# EAGLE design 6502_cable_ada (EAGLE 9.6.2)
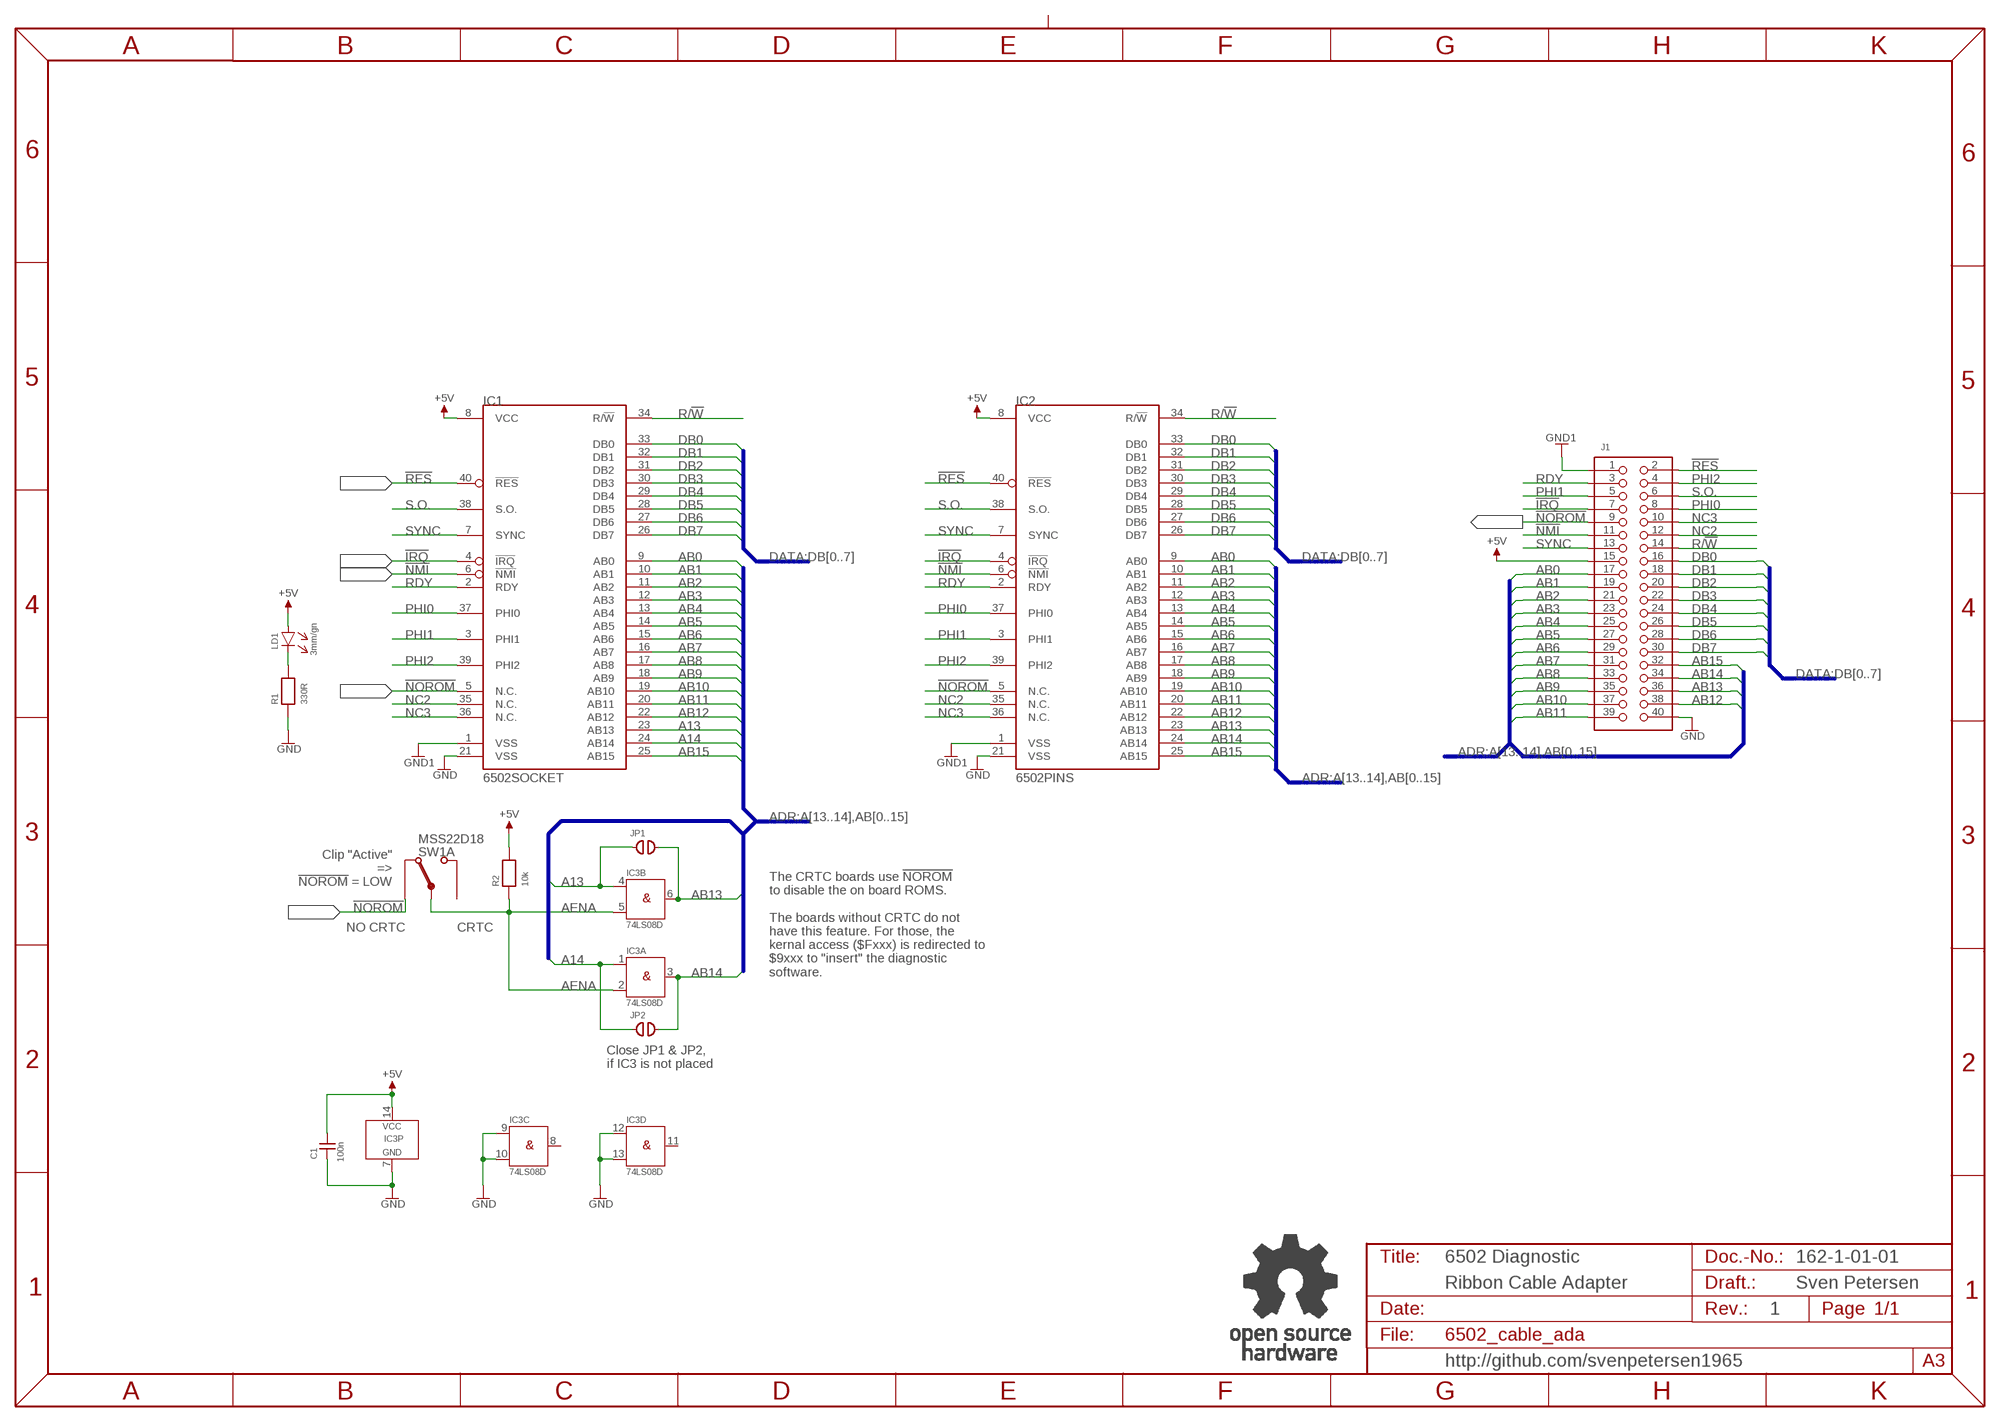
[diagram p0: schematic, sheet 1]

## Parts
C1  100n  C-0805  [0805]
IC1  6502SOCKET  [GS40P]
IC2  6502PINS  [DIL40_PINS_SS]
IC3  74LS08D  74HC08  [SO-14]
J1  PINHD-2X20WV  [2X20WV]
JP1  OPEN  [CP_OP]
JP2  OPEN  [CP_OP]
LD1  3mm/gn  3MM  [3MM]
R1  330R  RES040805  [0805]
R2  10k  RES040805  [0805]
SW1  MSS22D18  DPDT_9MM  [DPDT_9MM]
U$11  OPEN_SOURCE_HW  [OPENHW]

## Nets
!IRQ: IC1.4(!IRQ) IC2.4(!IRQ) J1.7
!NMI: IC1.6(!NMI) IC2.6(!NMI) J1.11
!NOROM: IC1.5(N.C.) IC2.5(N.C.) J1.9 SW1.3(A:DWN)
!RES: IC1.40(!RES) IC2.40(!RES) J1.2
+5V: C1.2 IC1.8(VCC) IC2.8(VCC) IC3.14(P:VCC) J1.15 LD1.A R2.2
A13: IC1.23(AB13) IC3.4(B:I0) JP1.1
A14: IC1.24(AB14) IC3.1(A:I0) JP2.1
AB0: IC1.9(AB0) IC2.9(AB0) J1.17
AB1: IC1.10(AB1) IC2.10(AB1) J1.19
AB2: IC1.11(AB2) IC2.11(AB2) J1.21
AB3: IC1.12(AB3) IC2.12(AB3) J1.23
AB4: IC1.13(AB4) IC2.13(AB4) J1.25
AB5: IC1.14(AB5) IC2.14(AB5) J1.27
AB6: IC1.15(AB6) IC2.15(AB6) J1.29
AB7: IC1.16(AB7) IC2.16(AB7) J1.31
AB8: IC1.17(AB8) IC2.17(AB8) J1.33
AB9: IC1.18(AB9) IC2.18(AB9) J1.35
AB10: IC1.19(AB10) IC2.19(AB10) J1.37
AB11: IC1.20(AB11) IC2.20(AB11) J1.39
AB12: IC1.22(AB12) IC2.22(AB12) J1.38
AB13: IC2.23(AB13) IC3.6(B:O) J1.36 JP1.2
AB14: IC2.24(AB14) IC3.3(A:O) J1.34 JP2.2
AB15: IC1.25(AB15) IC2.25(AB15) J1.32
AENA: IC3.2(A:I1) IC3.5(B:I1) R2.1 SW1.2(A:COM)
DB0: IC1.33(DB0) IC2.33(DB0) J1.16
DB1: IC1.32(DB1) IC2.32(DB1) J1.18
DB2: IC1.31(DB2) IC2.31(DB2) J1.20
DB3: IC1.30(DB3) IC2.30(DB3) J1.22
DB4: IC1.29(DB4) IC2.29(DB4) J1.24
DB5: IC1.28(DB5) IC2.28(DB5) J1.26
DB6: IC1.27(DB6) IC2.27(DB6) J1.28
DB7: IC1.26(DB7) IC2.26(DB7) J1.30
GND: C1.1 IC1.21(VSS) IC2.21(VSS) IC3.7(P:GND) IC3.9(C:I0) IC3.10(C:I1) IC3.12(D:I0) IC3.13(D:I1) J1.40 R1.1
GND1: IC1.1(VSS) IC2.1(VSS) J1.1
N$1: LD1.C(K) R1.2
NC2: IC1.35(N.C.) IC2.35(N.C.) J1.12
NC3: IC1.36(N.C.) IC2.36(N.C.) J1.10
PHI0: IC1.37(PHI0) IC2.37(PHI0) J1.8
PHI1: IC1.3(PHI1) IC2.3(PHI1) J1.5
PHI2: IC1.39(PHI2) IC2.39(PHI2) J1.4
R/!W: IC1.34(R/!W) IC2.34(R/!W) J1.14
RDY: IC1.2(RDY) IC2.2(RDY) J1.3
S.O.: IC1.38(S.O.) IC2.38(S.O.) J1.6
SYNC: IC1.7(SYNC) IC2.7(SYNC) J1.13
Unconnected: IC3.8(C:O) IC3.11(D:O) SW1.1(A:UP) SW1.4(B:DWN) SW1.5(B:COM) SW1.6(B:UP)

## Buses
DATA:DB[0..7]
ADR:A[13..14],AB[0..15]

## Notes on the sheet
- Clip "Active"
  =>
  !NOROM! = LOW
- NO CRTC | CRTC
- The CRTC boards use !NOROM!
  to disable the on board ROMS.
  
  The boards without CRTC do not
  have this feature. For those, the 
  kernal access ($Fxxx) is redirected to
  $9xxx to "insert" the diagnostic
  software.
- Close JP1 & JP2, 
  if IC3 is not placed
- 6502 Diagnostic | 162-1-01-01
- Ribbon Cable Adapter | Sven Petersen
- 1
- http://github.com/svenpetersen1965

## Library data of the parts
C1 = SMD:C-0805
IC1 IC2 = MOS:6502
IC3 = 74XX:74*08: Quad 2-input AND gate SO14
J1 = PINHEAD:PINHD-2X20
JP1 JP2 = Cutpad:OPEN: open Cutpad
LD1 = LED:3MM
R1 R2 = DISCRETE:RES04
SW1 = switches:DPDT_9MM
U$11 = Logo:OPEN_SOURCE_HW

## Board
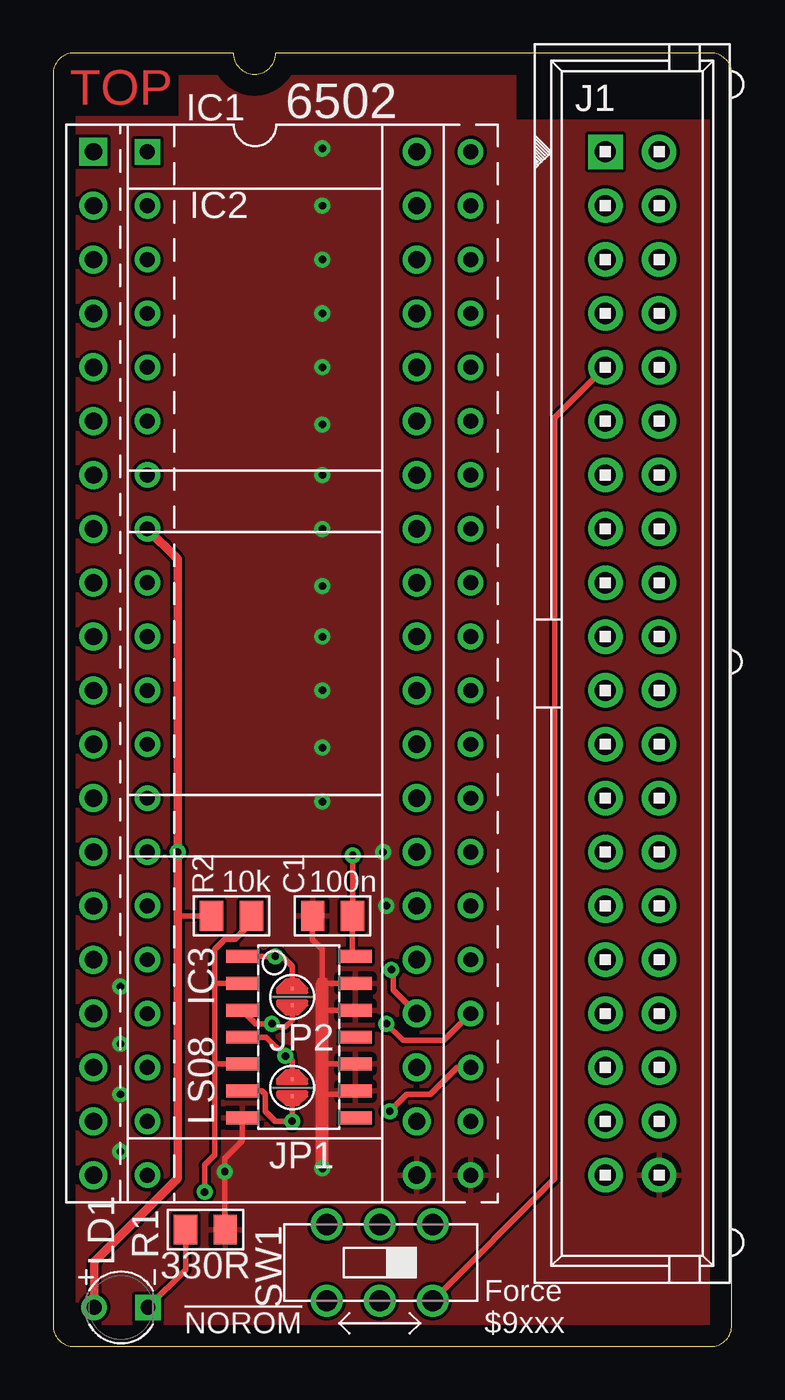
[diagram p1: board, top side]
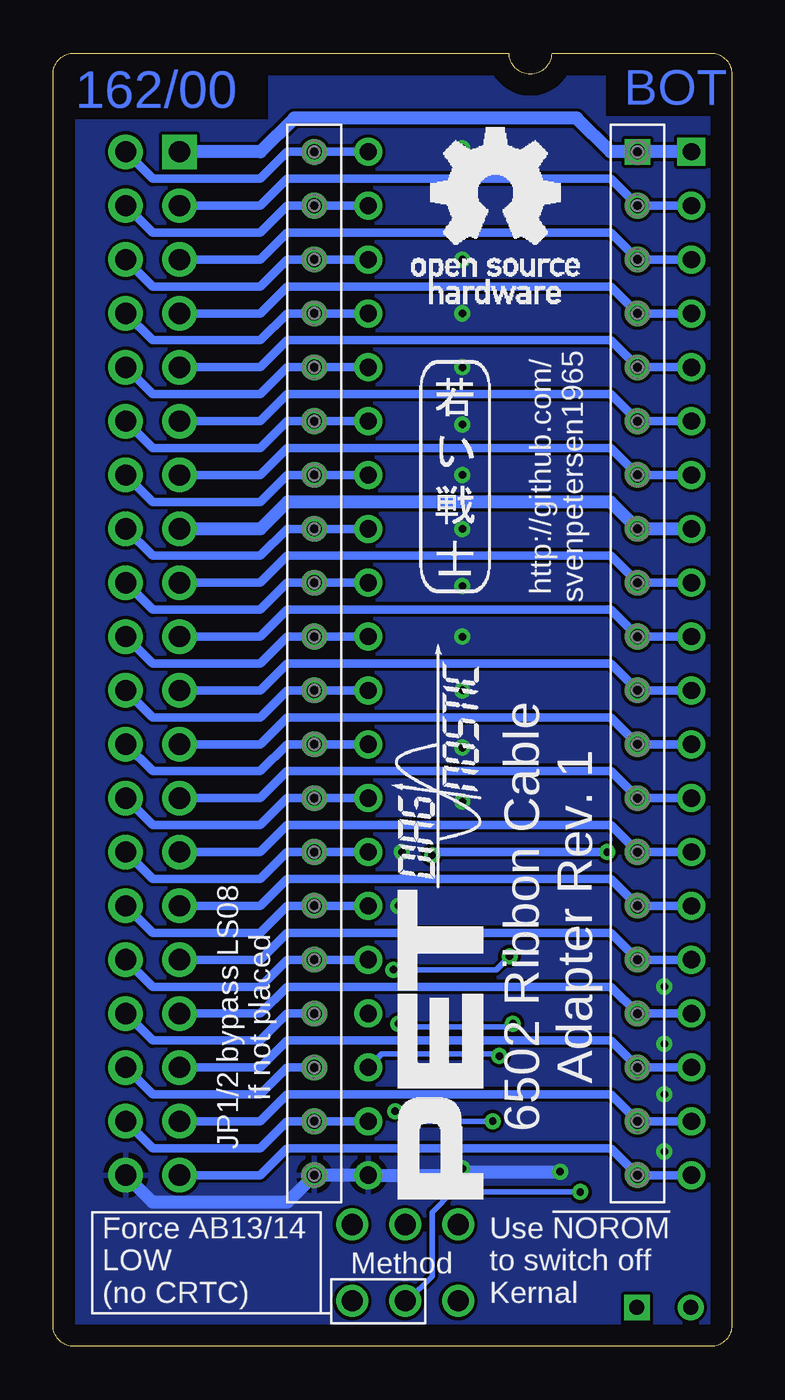
[diagram p2: board, bottom side, seen from below]

Size 32 x 61 mm. Coordinates in mm from the lower left corner, seen from the top.
Outline: 0,60 0,1 arc90 1,0 31,0 arc90 32,1 32,60 arc90 31,61 10.5,61 arc-180 8.5,61 1,61 arc90 0,60
Copper layers (1*16): Top 0.035mm / dielectric 1.5mm / Bottom 0.035mm
Design rules "default *": minimum track width 6mil, minimum drill 0.35mm, track to track 6mil, track to pad 6mil, pad to pad 6mil, via to via 6mil, smd to smd 6mil, copper to edge 40mil, drill to drill 6mil, minimum pad ring 10mil, minimum via ring 8mil, stop-mask expansion 4mil, vias tented up to drill 25mil, thermal gap 10mil
bRestrict: 3 lines

### Footprints (pad centres in the part's own frame; a part is rotated, then mirrored left to right if it is on the bottom)
0805 = smd 1.092 x 1.397: 1 -0.94,0; 2 0.94,0
GS40P = drill 0.813 square: 1 -24.13,-7.62 | drill 0.813: 2 -21.59,-7.62; 3 -19.05,-7.62; 4 -16.51,-7.62; 5 -13.97,-7.62; 6 -11.43,-7.62; 7 -8.89,-7.62; 8 -6.35,-7.62; 9 -3.81,-7.62; 10 -1.27,-7.62; 11 1.27,-7.62; 12 3.81,-7.62; 13 6.35,-7.62; 14 8.89,-7.62; 15 11.43,-7.62; 16 13.97,-7.62; 17 16.51,-7.62; 18 19.05,-7.62; 19 21.59,-7.62; 20 24.13,-7.62; 21 24.13,7.62; 22 21.59,7.62; 23 19.05,7.62; 24 16.51,7.62; 25 13.97,7.62; 26 11.43,7.62; 27 8.89,7.62; 28 6.35,7.62; 29 3.81,7.62; 30 1.27,7.62; 31 -1.27,7.62; 32 -3.81,7.62; 33 -6.35,7.62; 34 -8.89,7.62; 35 -11.43,7.62; 36 -13.97,7.62; 37 -16.51,7.62; 38 -19.05,7.62; 39 -21.59,7.62; 40 -24.13,7.62
DIL40_PINS_SS = drill 0.7 square: 1 -24.13,-7.62 | drill 0.7: 2 -21.59,-7.62; 3 -19.05,-7.62; 4 -16.51,-7.62; 5 -13.97,-7.62; 6 -11.43,-7.62; 7 -8.89,-7.62; 8 -6.35,-7.62; 9 -3.81,-7.62; 10 -1.27,-7.62; 11 1.27,-7.62; 12 3.81,-7.62; 13 6.35,-7.62; 14 8.89,-7.62; 15 11.43,-7.62; 16 13.97,-7.62; 17 16.51,-7.62; 18 19.05,-7.62; 19 21.59,-7.62; 20 24.13,-7.62; 21 24.13,7.62; 22 21.59,7.62; 23 19.05,7.62; 24 16.51,7.62; 25 13.97,7.62; 26 11.43,7.62; 27 8.89,7.62; 28 6.35,7.62; 29 3.81,7.62; 30 1.27,7.62; 31 -1.27,7.62; 32 -3.81,7.62; 33 -6.35,7.62; 34 -8.89,7.62; 35 -11.43,7.62; 36 -13.97,7.62; 37 -16.51,7.62; 38 -19.05,7.62; 39 -21.59,7.62; 40 -24.13,7.62
SO-14 = smd 0.61 x 1.524: 1 -3.81,-2.667; 2 -2.54,-2.667; 3 -1.27,-2.667; 4 0,-2.667; 5 1.27,-2.667; 6 2.54,-2.667; 7 3.81,-2.667; 8 3.81,2.667; 9 2.54,2.667; 10 1.27,2.667; 11 0,2.667; 12 -1.27,2.667; 13 -2.54,2.667; 14 -3.81,2.667
2X20WV = drill 1 pad 1.626 square: 1 -24.13,-1.27 | drill 1 pad 1.626: 2 -24.13,1.27; 3 -21.59,-1.27; 4 -21.59,1.27; 5 -19.05,-1.27; 6 -19.05,1.27; 7 -16.51,-1.27; 8 -16.51,1.27; 9 -13.97,-1.27; 10 -13.97,1.27; 11 -11.43,-1.27; 12 -11.43,1.27; 13 -8.89,-1.27; 14 -8.89,1.27; 15 -6.35,-1.27; 16 -6.35,1.27; 17 -3.81,-1.27; 18 -3.81,1.27; 19 -1.27,-1.27; 20 -1.27,1.27; 21 1.27,-1.27; 22 1.27,1.27; 23 3.81,-1.27; 24 3.81,1.27; 25 6.35,-1.27; 26 6.35,1.27; 27 8.89,-1.27; 28 8.89,1.27; 29 11.43,-1.27; 30 11.43,1.27; 31 13.97,-1.27; 32 13.97,1.27; 33 16.51,-1.27; 34 16.51,1.27; 35 19.05,-1.27; 36 19.05,1.27; 37 21.59,-1.27; 38 21.59,1.27; 39 24.13,-1.27; 40 24.13,1.27
CP_OP = smd 0.152 x 0.152: 1 -0.4,0; 2 0.4,0
3MM = drill 0.7: A -1.27,0 | drill 0.7 square: C 1.27,0
DPDT_9MM = drill 1: 1 -1.8,2.5; 2 -1.8,0; 3 -1.8,-2.5; 4 1.8,-2.5; 5 1.8,0; 6 1.8,2.5

### Placement (x,y rotation side)
C1  13.18,20.3 0 top
IC1  9.53,32.21 270 top
IC2  12.06,32.21 270 top
IC3  11.59,14.59 270 top
J1  27.3,32.21 270 top
JP1  11.27,12.21 270 top
JP2  11.27,16.49 270 top
LD1  3.21,1.84 0 top
R1  7.19,5.51 180 top
R2  8.41,20.3 180 top
SW1  15.4,3.95 90 top
U$11  15.08,49.2 0 bottom
U$12  [PCB-TITLE/]  0,69.04 0 top  (outside the outline)
U$13  [2LAYER]  0.79,58.56 0 top
U$14  [SVEN_TAG]  13.01,41.14 0 bottom
U$17  [DIAG_SMALL]  11.82,21.59 90 bottom
U$29  [PET]  11.75,6.97 90 bottom

### Tracks (layer width: path | path; a pad name or v marks a point on that pad's centre or on a via)
!IRQ
  Bottom 0.406: IC1.4 IC2.4 5.71,49.99 20.95,49.99 22.23,48.72 J1.7
!NMI
  Bottom 0.406: IC1.6 IC2.6 5.71,44.91 20.95,44.91 22.23,43.64 J1.11
!NOROM
  Top 0.254: J1.9 23.65,43.8 23.65,7.92 17.9,2.17 SW1.3
  Bottom 0.406: IC1.5 IC2.5 5.71,47.45 20.95,47.45 22.23,46.18 J1.9
!RES
  Bottom 0.406: IC1.40 IC2.40 20.95,56.34 22.23,55.07 27.3,55.07 J1.2
+5V  (via drill 0.35)
  Top 0.254: R2.2 5.87,20.3 | v14.13,23.16 14.13,20.32 C1.2 14.12,18.54 IC3.14
  Top 0.406: LD1.A 1.94,3.98 5.87,7.92 5.87,20.3 v5.87,23.32 5.87,37.13 IC2.8
  Bottom 0.406: v5.87,23.32 13.97,23.32 v14.13,23.16
  Bottom 0.61: IC1.8 IC2.8 5.71,39.83 20.95,39.83 22.23,38.56 J1.15
A13  (via drill 0.35)
  Top 0.254: IC3.4 10.06,14.59 v10.95,13.7 11.05,13.7 11.27,13.48 JP1.1
  Bottom 0.254: IC1.23 16.51,13.79 10.95,13.79 v10.95,13.7
A14  (via drill 0.35)
  Top 0.254: IC1.24 16.03,16.81 16.03,17.76 v15.95,17.76 | IC3.1 v10.48,18.4 10.79,18.4 11.27,17.92 JP2.1
  Bottom 0.254: v15.95,17.76 11.11,17.76 v10.48,18.4
AB0
  Bottom 0.406: IC1.9 IC2.9 5.71,37.29 20.95,37.29 22.23,36.02 J1.17
AB1
  Bottom 0.406: IC1.10 IC2.10 5.71,34.75 20.95,34.75 22.23,33.48 J1.19
AB2
  Bottom 0.406: IC1.11 IC2.11 5.71,32.21 20.95,32.21 22.23,30.94 J1.21
AB3
  Bottom 0.406: IC1.12 IC2.12 5.71,29.67 20.95,29.67 22.23,28.4 J1.23
AB4
  Bottom 0.406: IC1.13 IC2.13 5.71,27.13 20.95,27.13 22.23,25.86 J1.25
AB5
  Bottom 0.406: IC1.14 IC2.14 5.71,24.59 20.95,24.59 22.23,23.32 J1.27
AB6
  Bottom 0.406: IC1.15 IC2.15 5.71,22.05 20.95,22.05 22.23,20.78 J1.29
AB7
  Bottom 0.406: IC1.16 IC2.16 5.71,19.51 20.95,19.51 22.23,18.24 J1.31
AB8
  Bottom 0.406: IC1.17 IC2.17 5.71,16.97 11.43,16.97 20.95,16.97 22.23,15.7 J1.33
AB9
  Bottom 0.406: IC1.18 IC2.18 5.71,14.43 20.95,14.43 22.23,13.16 J1.35
AB10
  Bottom 0.406: IC1.19 IC2.19 5.71,11.89 20.95,11.89 22.23,10.62 J1.37
AB11
  Bottom 0.406: IC1.20 IC2.20 5.71,9.35 20.95,9.35 22.23,8.08 J1.39
AB12
  Bottom 0.406: IC1.22 IC2.22 20.95,10.62 22.23,9.35 27.3,9.35 J1.38
AB13  (via drill 0.35)
  Top 0.254: IC2.23 19.05,13.16 17.78,11.89 16.67,11.89 v15.88,11.1 | IC3.6 9.84,12.05 10,11.89 10,11.1 10.48,10.62 v11.27,10.62 JP1.2
  Bottom 0.254: v15.88,11.1 15.4,10.62 v11.27,10.62
  Bottom 0.406: IC2.23 20.95,13.16 22.23,11.89 27.3,11.89 J1.36
AB14  (via drill 0.35)
  Top 0.254: IC2.24 18.41,14.43 16.51,14.43 v15.72,15.22 | IC3.3 9.56,15.22 v10.32,15.22 10.48,15.06 10.95,15.06 11.27,15.38 JP2.2
  Bottom 0.254: v15.72,15.22 15.56,15.06 10.48,15.06 v10.32,15.22
  Bottom 0.406: IC2.24 20.95,15.7 22.23,14.43 27.3,14.43 J1.34
AB15
  Bottom 0.406: IC1.25 IC2.25 20.95,18.24 22.23,16.97 27.3,16.97 J1.32
AENA  (via drill 0.35)
  Top 0.254: IC3.2 7.62,17.13 | 7.62,17.13 7.62,18.72 8.1,19.19 8.57,19.19 9.35,19.97 R2.1 | IC3.5 7.62,13.32 | 7.62,17.13 7.62,13.32 | 7.62,13.32 7.62,9.03 7.14,8.56 v7.14,7.29
  Bottom 0.254: v7.14,7.29 13.18,7.29 14.13,6.33 14.13,3.32 15.29,2.15 SW1.2
DB0
  Bottom 0.406: IC1.33 IC2.33 20.95,38.56 22.23,37.29 27.3,37.29 J1.16
DB1
  Bottom 0.406: IC1.32 IC2.32 20.95,36.02 22.23,34.75 27.3,34.75 J1.18
DB2
  Bottom 0.406: IC1.31 IC2.31 20.95,33.48 22.23,32.21 27.3,32.21 J1.20
DB3
  Bottom 0.406: IC1.30 IC2.30 20.95,30.94 22.23,29.67 27.3,29.67 J1.22
DB4
  Bottom 0.406: IC1.29 IC2.29 20.95,28.4 22.23,27.13 27.3,27.13 J1.24
DB5
  Bottom 0.406: IC1.28 IC2.28 20.95,25.86 22.23,24.59 27.3,24.59 J1.26
DB6
  Bottom 0.406: IC1.27 IC2.27 20.95,23.32 22.23,22.05 27.3,22.05 J1.28
DB7
  Bottom 0.406: IC1.26 IC2.26 20.95,20.78 22.23,19.51 27.3,19.51 J1.30
GND  (via drill 0.35)
  Top 0.254: IC3.9 14.1,11.89 12.7,11.89 | IC3.10 12.7,13.32 | IC3.12 12.7,15.86 | IC3.13 12.7,17.13 12.7,18.72 12.22,19.19 12.22,20.29 C1.1 | R1.1 8.1,5.54 v8.1,8.24 8.1,8.87 8.92,9.7 IC3.7
  Top 0.61: v12.7,8.4 12.7,11.89 12.7,13.32 12.7,15.86 12.7,17.13
  Bottom 0.61: J1.40 27.3,6.81 22.23,6.81 20.95,6.81 IC2.21 IC1.21 13.02,8.08 v12.7,8.4 12.54,8.24 v8.1,8.24
  other vias: 12.7,56.5 12.7,53.8 12.7,51.26 12.7,48.72 12.7,46.18 12.7,43.48 12.7,41.1 12.7,38.56 12.7,35.86 12.7,33.48 12.7,30.94 12.7,28.24 12.7,25.7 15.56,23.32 15.72,20.78 3.17,16.97 3.17,14.27 3.17,11.89 3.17,9.19
  pour Bottom: 6.03,60.31 6.03,57.93 0.64,57.93 0.64,1.09 1.11,0.62 30.64,0.62 31.27,1.25 31.27,57.77 21.75,57.77 21.75,59.99 21.75,60.31
  pour Top: 6.03,60.31 6.03,57.93 0.64,57.93 0.64,1.09 1.11,0.62 30.64,0.62 31.27,1.25 31.27,57.77 21.75,57.77 21.75,60.31
GND1
  Bottom 0.61: IC1.1 IC2.1 5.71,56.34 7.3,57.93 20.64,57.93 22.23,56.34 J1.1
N$1
  Top 0.254: LD1.C 6.25,3.61 R1.2
NC2
  Bottom 0.406: IC1.35 IC2.35 20.95,43.64 22.23,42.37 27.3,42.37 J1.12
NC3
  Bottom 0.406: IC1.36 IC2.36 20.95,46.18 22.23,44.91 27.3,44.91 J1.10
PHI0
  Bottom 0.406: IC1.37 IC2.37 20.95,48.72 22.23,47.45 27.3,47.45 J1.8
PHI1
  Bottom 0.406: IC1.3 IC2.3 5.71,52.53 20.95,52.53 22.23,51.26 J1.5
PHI2
  Bottom 0.406: IC1.39 IC2.39 20.95,53.8 22.23,52.53 27.3,52.53 J1.4
R/!W
  Bottom 0.406: IC1.34 IC2.34 20.95,41.1 22.23,39.83 27.3,39.83 J1.14
RDY
  Bottom 0.406: IC1.2 IC2.2 5.71,55.07 20.95,55.07 22.23,53.8 J1.3
S.O.
  Bottom 0.406: IC1.38 IC2.38 20.95,51.26 22.23,49.99 27.3,49.99 J1.6
SYNC
  Bottom 0.406: IC1.7 IC2.7 5.71,42.37 20.95,42.37 22.23,41.1 J1.13

### Text on the board
Bottom: 162/00
tPlace: 6502
bPlace: http://github.com/ / svenpetersen1965 | 6502 Ribbon Cable / Adapter Rev. 1
tNames: LS08 | !NOROM | Force / $9xxx
bNames: JP1/2 bypass LS08 / if not placed | Method | Use !NOROM! / to switch off / Kernal | Force AB13/14 / LOW / (no CRTC)
Document: 162-2-01-01 | Sven Petersen / 2023 | 35µm | 2 | 1